# Altium schematic sheet N-DAP.SchDoc
size A4; DocumentNumber: 1; SheetNumber: 1; SheetTotal: 1; PageSetup: Record=PageOptions|CenterHorizontal=True|CenterVertical=True|PrintScale=0.05|XCorrection=1.00|YCorrection=1.00|PrintKind=0|BorderSize=5000000|LeftOffset=0|BottomOffset=0|Orientation=2|PaperLength=1000|PaperWidth=1000|Scale=100|PaperSource=7|PrintQuality=-3|MediaType=1|DitherType=10|PrintScaleMode=1|PaperKind=12mm|PaperIndex=126
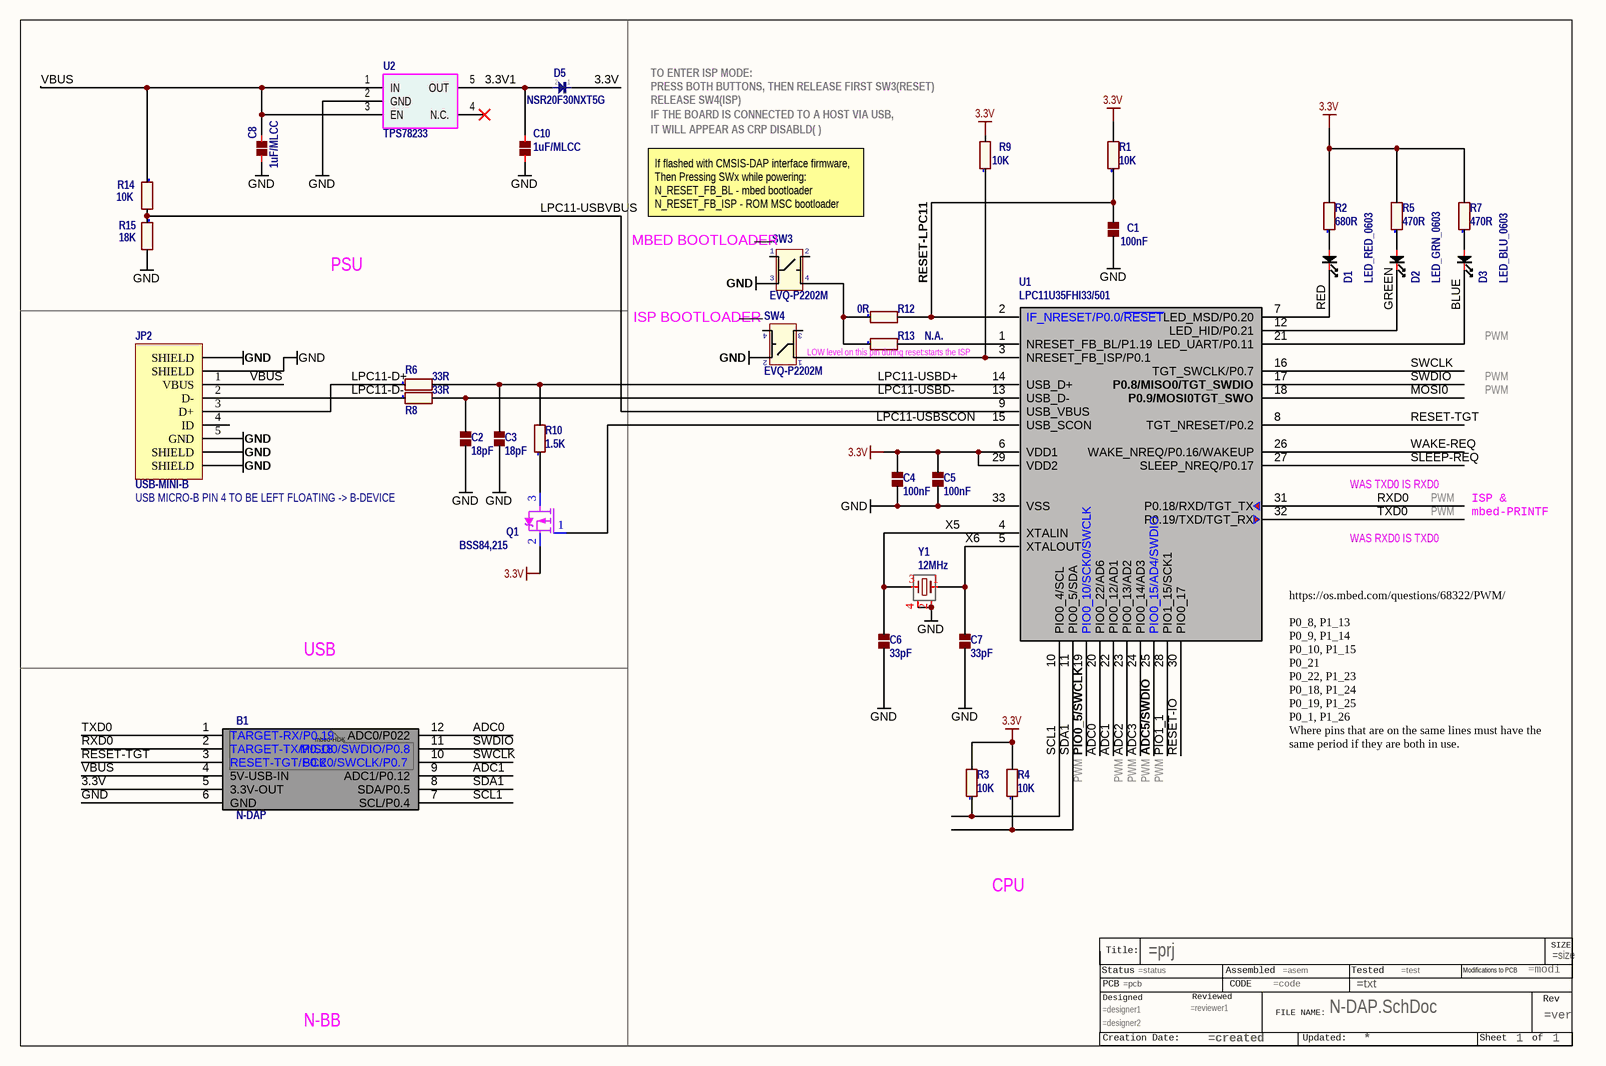
[diagram p0: N-DAP.SchDoc]

## Parts
?*??  FILE_NAME: N-DAP.SchDoc  PAGE NUMPER: 1  (hidden comment: TITLEBLOCK3)  (graphical)
B1  N-DAP  [N-DAP]  (no BOM)
C1  100nF  [0402_CAP]
C2  18pF  [0402_CAP]
C3  18pF  [0402_CAP]
C4  100nF  [0402_CAP]
C5  100nF  [0402_CAP]
C6  33pF  [0402_CAP]
C7  33pF  [0402_CAP]
C8  1uF/MLCC  [0402_CAP]
C10  1uF/MLCC  [0402_CAP]
D1  LED_RED_0603  [0603_LED_RED]
D2  LED_GRN_0603  [0603_LED_GRN]
D3  LED_BLU_0603  [0603_LED_BLU]
D5  NSR20F30NXT5G  [0603_DIODE-NSR20F30]
JP2  USB-MINI-B  [USB-MINI-B-HIR-UX60A-MB-5ST-SMALL]
Q1  BSS84,215  [SOT323/SC70-3_SMALL]
R1  10K  [0402_res]
R2  680R  [0402_res]
R3  10K  [0402_res]
R4  10K  [0402_res]
R5  470R  [0402_RES]
R6  33R  [0402_res]
R7  470R  [0402_RES]
R8  33R  [0402_res]
R9  10K  [0402_res]
R10  1.5K  [0402_res]
R12  0R  [0402_res]
R13  N.A.  [0402_res]  (no BOM)
R14  10K  [0402_RES]
R15  18K  [0402_RES]
SW3  EVQ-P2202M  [BUTTON_4.7x3.5mm]
SW4  EVQ-P2202M  [BUTTON_4.7x3.5mm]
U1  LPC11U35FHI33/501  [QFN32_0.5mm_PAD]
U2  TPS78233  [SOT23-5_0.95mm-NOSILK]
Y1  12MHz  [CRY-SMD4-2.5x2mm]

## Nets
3.3V: B1.5(3.3V-OUT) C4.1 C5.1 D5.1 Q1.2(S) R1.2 R2.2 R3.2 R4.2 R5.2 R7.2 R9.2 U1.6(VDD1) U1.29(VDD2)
GND: B1.6(GND) C1.2 C2.2 C3.2 C4.2 C5.2 C6.2 C7.2 C8.1 C10.1 JP2.5(GND) JP2.6(SHIELD) JP2.7(SHIELD) JP2.8(SHIELD) JP2.9(SHIELD) R15.2 SW3.3 SW4.2 U1.33(VSS) U2.2(GND) Y1.2 Y1.4
3.3V1: C10.2 D5.2 U2.5(OUT)
ADC0: B1.12(ADC0/P022) U1.20(PIO0_22/AD6)
ADC1: B1.9(ADC1/P0.12) U1.22(PIO0_12/AD1)
ADC2: U1.23(PIO0_13/AD2)
ADC3: U1.24(PIO0_14/AD3)
ADC5/SWDIO: U1.25(PIO0_15/AD4/SWDIO)
BLUE: D3.2 U1.21(LED_UART/P0.11)
GREEN: D2.2 U1.12(LED_HID/P0.21)
LPC11-D+: JP2.3(D+) R6.1
LPC11-D-: JP2.2(D-) R8.1
LPC11-USBD+: C3.1 R6.2 R10.2 U1.14(USB_D+)
LPC11-USBD-: C2.1 R8.2 U1.13(USB_D-)
LPC11-USBSCON: Q1.1(G) U1.15(USB_SCON)
LPC11-USBVBUS: R14.2 R15.1 U1.9(USB_VBUS)
MOSI0: U1.18(P0.9/MOSI0TGT_SWO)
PIO0_5/SWCLK: U1.19(PIO0_10/SCK0/SWCLK)
PIO1_1: U1.28(PIO1_15/SCK1)
RED: D1.2 U1.7(LED_MSD/P0.20)
RESET-IO: U1.30(PIO0_17)
RESET-LPC11: C1.1 R1.1 R12.2 U1.2(IF_NRESET/P0.0/~{RESET})
RESET-TGT: B1.3(RESET-TGT/P0.2) U1.8(TGT_NRESET/P0.2)
RXD0: B1.2(TARGET-TX/P0.18) U1.31(P0.18/RXD/TGT_TX)
SCL1: B1.7(SCL/P0.4) R3.1 U1.10(PIO0_4/SCL)
SDA1: B1.8(SDA/P0.5) R4.1 U1.11(PIO0_5/SDA)
SLEEP-REQ: U1.27(SLEEP_NREQ/P0.17)
SWCLK: B1.10(SCK0/SWCLK/P0.7) U1.16(TGT_SWCLK/P0.7)
SWDIO: B1.11(MISO0/SWDIO/P0.8) U1.17(P0.8/MISO0/TGT_SWDIO)
TXD0: B1.1(TARGET-RX/P0.19) U1.32(P0.19/TXD/TGT_RX)
VBUS: B1.4(5V-USB-IN) C8.2 JP2.1(VBUS) R14.1 U2.1(IN) U2.3(EN)
WAKE-REQ: U1.26(WAKE_NREQ/P0.16/WAKEUP)
X5: C6.1 U1.4(XTALIN) Y1.3
X6: C7.1 U1.5(XTALOUT) Y1.1
NetD1_1: D1.1 R2.1
NetD2_1: D2.1 R5.1
NetD3_1: D3.1 R7.1
NetQ1_3: Q1.3(D) R10.1
NetR9_1: R9.1 SW4.1 U1.3(NRESET_FB_ISP/P0.1)
NetR12_1: R12.1 R13.1 SW3.4
NetR13_2: R13.2 U1.1(NRESET_FB_BL/P1.19)

Not connected (* = marked no-connect by the designer): ?*?? ?1; JP2 4(ID); SW3 1 2; SW4 3 4; U2 4(N.C.)*

## Notes on the sheet
- TO ENTER ISP MODE:
- PRESS BOTH BUTTONS, THEN RELEASE FIRST SW3(RESET)
- RELEASE SW4(ISP)
- IF THE BOARD IS CONNECTED TO A HOST VIA USB,
- IT WILL APPEAR AS CRP DISABLD( )
- (near SW3) MBED BOOTLOADER
- (near SW3) If flashed with CMSIS-DAP interface firmware,
  Then Pressing SWx while powering:
  N_RESET_FB_BL - mbed bootloader
  N_RESET_FB_ISP - ROM MSC bootloader
- PSU
- ISP BOOTLOADER
- LOW level on this pin during reset:starts the ISP
- PWM
- (near JP2) USB MICRO-B PIN 4 TO BE LEFT FLOATING -> B-DEVICE
- WAS TXD0 IS RXD0
- ISP &
- mbed-PRINTF
- WAS RXD0 IS TXD0
- USB
- (near U1) https://os.mbed.com/questions/68322/PWM/
  P0_8, P1_13
  P0_9, P1_14
  P0_10, P1_15
  P0_21
  P0_22, P1_23
  P0_18, P1_24
  P0_19, P1_25
  P0_1, P1_26
  Where pins that are on the same lines must have the same period if they are both in use.
- CPU
- N-BB
- (in symbol N-DAP) mbed-HDK
- (in symbol TITLEBLOCK3) SIZE; Title:; Status; Assembled; Tested; Modifications to PCB; PCB; CODE; Designed; Reviewed; Rev; FILE NAME:; Creation Date:; Updated:; Sheet; of

## Library data of the parts
C1-C8 C10 = C: CAPACITOR; Divider: 1; Supplier 1: Mouser
  C1 C4 C5: Supplier Part Number 1: 710-885012105016
  C2 C3: Supplier Part Number 1: 791-0402N180F500CT
  C6 C7: Supplier Part Number 1: 710-885012005058
  C8 C10: Supplier Part Number 1: 963-JMK105BJ105KP-F
D1-D3 = LED: Divider: 1; Supplier 1: Mouser
  D1: Supplier Part Number 1: 720-LSQ976-NR-1
  D2: Supplier Part Number 1: 604-APT1608SGC
  D3: Supplier Part Number 1: 720-LBQ39GL2N2351
D5 = DIODE_NSR20F30: SCHOTTKY DIODE 0603; Divider: 1.3; Supplier Part Number 1: 863-NSR20F30NXT5G; Supplier 1: Mouser
JP2 = USB-MINI-B: Divider: 1; Supplier 1: Mouser; Supplier Part Number 1: 798-UX60A-MB-5ST
Q1 = mosfet BSS84: POWER MOSFET-P SOT23; Divider: 1; Supplier 1: Mouser; Supplier Part Number 1: 621-BSS84W-F
R1-R10 R12-R15 = R: RESISTOR; Divider: 1; Supplier 1: Mouser
  R1 R3 R4 R9 R14: Supplier Part Number 1: 71-CRCW040210K0FKEDC
  R2: Supplier Part Number 1: 71-CRCW0402680RFKEDC
  R5 R7: Supplier Part Number 1: 71-CRCW0402470RFKEDC
  R6 R8: Supplier Part Number 1: 71-CRCW040233R0FKEDC
  R10: Supplier Part Number 1: 71-CRCW04021K50FKEDC
  R12 R13: Supplier Part Number 1: 71-CRCW04020000Z0EDC
  R15: Supplier Part Number 1: 71-CRCW0402-18K-E3
SW3 SW4 = BUTTON_TACT: BUTTON TACTILE; Divider: 1; Supplier 1: Mouser; Supplier Part Number 1: 667-EVQ-P2202M
U1 = LPC11U35FHI33/501: Divider: 1; Supplier 1: Mouser; Supplier Part Number 1: 771-LPC11U35FHI33501
U2 = NCP702N: Divider: 1; Supplier 1: Mouser; Supplier Part Number 1: 595-TPS78233DDCR
Y1 = XTAL_4PINS: CRYSTAL; Divider: 1; Supplier 1: Mouser; Supplier Part Number 1: 717-8Z-12.000MAAJ-T
?*?? = TITLEBLOCK3: size: =size; CREATION DATE: =created; UPDATED: *; PAGE COUNT: 1; VERSION: =ver; pr: =prj; ASSEMBLY: =asem; MODIFICATIONS TO OPERATE: =modi; TESTED: =test; PCB: =pcb; STATUS: =status; CODE: =code; TEXT: =txt; designer1: =designer1; designer2: =designer2; reviewer1: =reviewer1